# EAGLE design Isolator_14 (EAGLE 9.6.2)
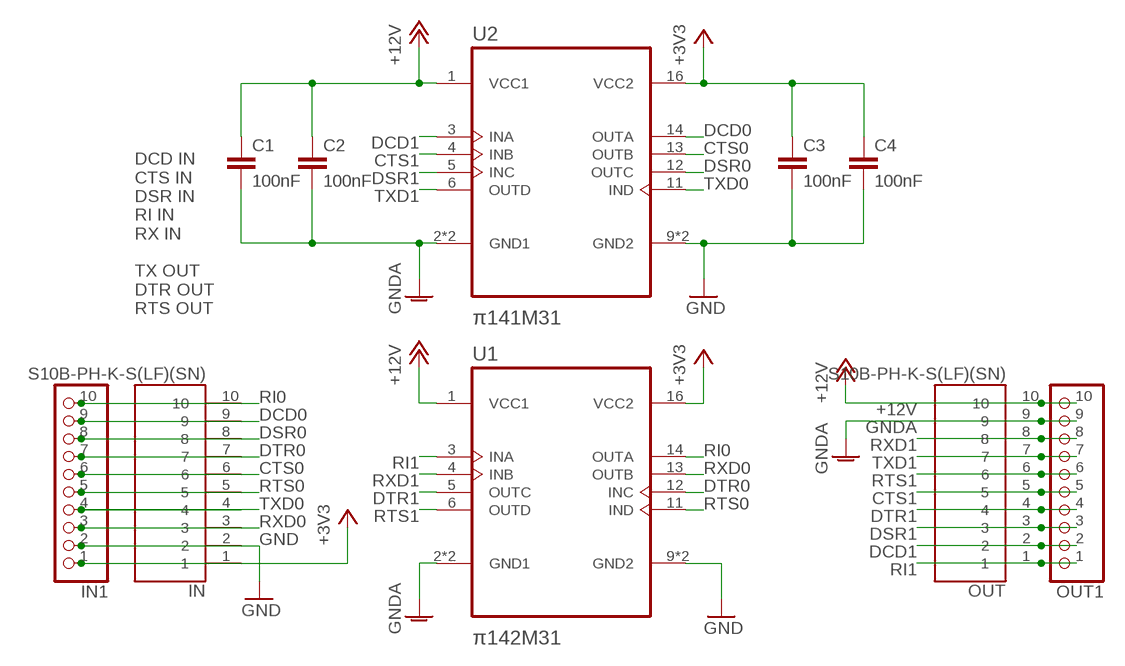
[diagram p0: schematic, sheet 1]

## Parts
C1  100nF  C-EUC0805  [C0805]
C2  100nF  C-EUC0805  [C0805]
C3  100nF  C-EUC0805  [C0805]
C4  100nF  C-EUC0805  [C0805]
IN  S10B-PH-K-S(LF)(SN)  [JST_S10B-PH-K-S(LF)(SN)]
IN1  PINHD-1X10  [1X10]
OUT  S10B-PH-K-S(LF)(SN)  [JST_S10B-PH-K-S(LF)(SN)]
OUT1  PINHD-1X10  [1X10]
U1  π142M31  π142X3X  [SOIC-16]
U2  π141M31  π141X3X  [SOIC-16]

## Nets
+3V3: C3.1 C4.1 IN1.1 IN.1 U1.16(VCC2) U2.16(VCC2)
+12V: C1.1 C2.1 OUT1.10 OUT.10 U1.1(VCC1) U2.1(VCC1)
CTS0: IN1.6 IN.6 U2.13(OUTB)
CTS1: OUT1.5 OUT.5 U2.4(INB)
DCD0: IN1.9 IN.9 U2.14(OUTA)
DCD1: OUT1.2 OUT.2 U2.3(INA)
DSR0: IN1.8 IN.8 U2.12(OUTC)
DSR1: OUT1.3 OUT.3 U2.5(INC)
DTR0: IN1.7 IN.7 U1.12(INC)
DTR1: OUT1.4 OUT.4 U1.5(OUTC)
GND: C3.2 C4.2 IN1.2 IN.2 U1.9(GND2) U1.15(GND2) U2.9(GND2) U2.15(GND2)
GNDA: C1.2 C2.2 OUT1.9 OUT.9 U1.2(GND1) U1.8(GND1) U2.2(GND1) U2.8(GND1)
RI0: IN1.10 IN.10 U1.14(OUTA)
RI1: OUT1.1 OUT.1 U1.3(INA)
RTS0: IN1.5 IN.5 U1.11(IND)
RTS1: OUT1.6 OUT.6 U1.6(OUTD)
RXD0: IN1.3 IN.3 U1.13(OUTB)
RXD1: OUT1.8 OUT.8 U1.4(INB)
TXD0: IN1.4 IN.4 U2.11(IND)
TXD1: OUT1.7 OUT.7 U2.6(OUTD)

## Notes on the sheet
- DCD IN
  CTS IN
  DSR IN
  RI IN
  RX IN
  
  TX OUT
  DTR OUT
  RTS OUT

## Library data of the parts
C1-C4 = rcl:C-EU: CAPACITOR, European symbol; SPICEPREFIX: C
IN OUT = S10B-PH-K-S_LF__SN_:S10B-PH-K-S(LF)(SN): PH Series 6 Position 2 mm Pitch Through Hole Side Entry Shrouded Header Check availability <https://pricing.snapeda.com/parts/S6B-PH-K-S%28LF%29%28SN%29/JST%20Sales/view-part?ref=eda>; AVAILABILITY: In Stock; DESCRIPTION: Connector Header Through Hole, Right Angle 6 position 0.079 (2.00mm); MF: JST Sales; MP: S6B-PH-K-S(LF)(SN); PACKAGE: None; PRICE: None; PURCHASE-URL: https://pricing.snapeda.com/search/part/S6B-PH-K-S(LF)(SN)/?ref=eda
IN1 OUT1 = pinhead:PINHD-1X10: PIN HEADER
U1 = π14XX3X:π142X3X: Check availability <https://pricing.snapeda.com/parts/ISO7240CDWR/Texas%20Instruments/view-part?ref=eda>; AVAILABILITY: In Stock; DESCRIPTION: Quad-channel, 4/0, 25-Mbps digital isolator; MF: Texas Instruments; MP: ISO7240CDWR; PACKAGE: SOIC-16 Texas Instruments; PRICE: None; PURCHASE-URL: https://pricing.snapeda.com/search/part/ISO7240CDWR/?ref=eda
U2 = π14XX3X:π141X3X: Check availability <https://pricing.snapeda.com/parts/ISO7240CDWR/Texas%20Instruments/view-part?ref=eda>; AVAILABILITY: In Stock; DESCRIPTION: Quad-channel, 4/0, 25-Mbps digital isolator; MF: Texas Instruments; MP: ISO7240CDWR; PACKAGE: SOIC-16 Texas Instruments; PRICE: None; PURCHASE-URL: https://pricing.snapeda.com/search/part/ISO7240CDWR/?ref=eda

## Board
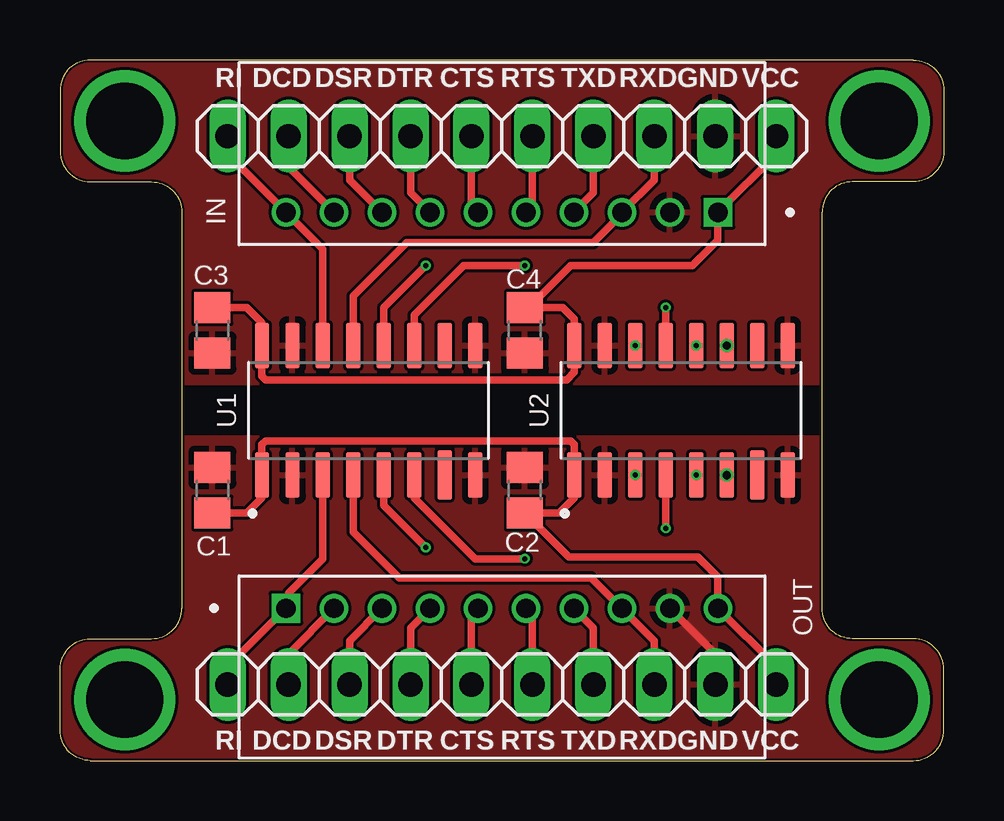
[diagram p1: board, top side]
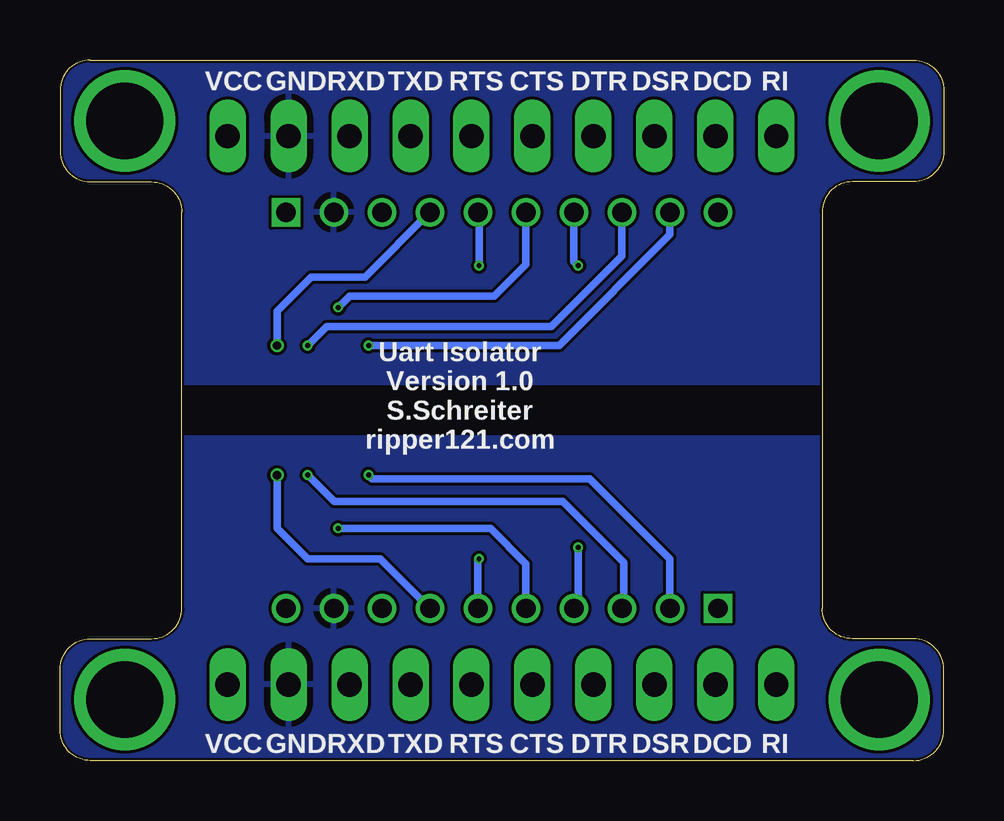
[diagram p2: board, bottom side, seen from below]

Size 36.83 x 29.21 mm. Coordinates in mm from the lower left corner, seen from the top.
Outline: 5.08,22.86 5.08,6.35 arc-90 3.81,5.08 1.27,5.08 arc90 0,3.81 0,1.27 arc90 1.27,0 35.56,0 arc90 36.83,1.27 36.83,3.81 arc90 35.56,5.08 33.02,5.08 arc-90 31.75,6.35 31.75,22.86 arc-90 33.02,24.13 35.56,24.13 arc90 36.83,25.4 36.83,27.94 arc90 35.56,29.21 1.27,29.21 arc90 0,27.94 0,25.4 arc90 1.27,24.13 3.81,24.13 arc-90 5.08,22.86
Copper layers (1*16): Top 0.035mm / dielectric 1.6mm / Bottom 0.035mm
Design rules "jlcpcb-2-layer *": minimum track width 12mil, minimum drill 0.2mm, track to track 5mil, track to pad 5mil, pad to pad 5mil, via to via 5mil, smd to smd 0mil, copper to edge 0.1mm, drill to drill 5mil, minimum pad ring 4mil, minimum via ring 4mil, stop-mask expansion 3mil, vias tented up to drill 100mil, thermal gap 10mil

### Footprints (pad centres in the part's own frame; a part is rotated, then mirrored left to right if it is on the bottom)
C0805 = smd 1.3 x 1.5: 1 -0.95,0; 2 0.95,0
JST_S10B-PH-K-S(LF)(SN) = drill 0.8 pad 1.2 square: 1 -9,0 | drill 0.8 pad 1.2: 2 -7,0; 3 -5,0; 4 -3,0; 5 -1,0; 6 1,0; 7 3,0; 8 5,0; 9 7,0; 10 9,0
1X10 = drill 1.016 long: 1 -11.43,0; 2 -8.89,0; 3 -6.35,0; 4 -3.81,0; 5 -1.27,0; 6 1.27,0; 7 3.81,0; 8 6.35,0; 9 8.89,0; 10 11.43,0
SOIC-16 = smd 1.9 x 0.6: 1 -2.7,4.445; 2 -2.7,3.175; 3 -2.7,1.905; 4 -2.7,0.635; 5 -2.7,-0.635; 6 -2.7,-1.905; 8 -2.7,-4.445; 9 2.7,-4.445; 10 2.7,-3.175; 11 2.7,-1.905; 12 2.7,-0.635; 13 2.7,0.635; 14 2.7,1.905; 15 2.7,3.175; 16 2.7,4.445 | smd 2.06 x 0.6: 7 -2.7,-3.175

### Placement (x,y rotation side)
C1  6.35,11.27 90 top
C2  19.37,11.27 90 top
C3  6.35,17.94 270 top
C4  19.37,17.94 270 top
IN  18.41,22.86 180 top
IN1  18.41,26.04 180 top
OUT  18.41,6.35 0 top
OUT1  18.41,3.17 0 top
U1  12.86,14.61 90 top
U2  25.88,14.61 90 top

### Tracks (layer width: path | path; a pad name or v marks a point on that pad's centre or on a via)
+3V3
  Top 0.305: C3.1 7.78,18.89 8.41,18.26 U1.16 8.41,16.03 8.57,15.88 21.11,15.88 21.43,16.19 U2.16 21.43,18.41 20.96,18.89 C4.1 19.53,18.89 21.27,20.64 26.35,20.64 27.41,21.7 IN.1 29.84,25.29 IN1.1
+12V
  Top 0.305: OUT1.10 29.84,3.92 OUT.10 27.41,7.66 26.57,8.5 21.19,8.5 C2.1 20.8,10.32 21.43,10.95 U2.1 21.43,13.18 21.27,13.34 8.57,13.34 8.41,13.18 U1.1 8.41,10.95 7.78,10.32 C1.1
CTS0  (via drill 0.2)
  Top 0.305: IN1.6 17.14,23.13 IN.6 | U2.13 v25.24,18.89
  Bottom 0.305: v25.24,18.89 24.77,19.37 18.73,19.37 17.41,20.68 IN.6
CTS1  (via drill 0.2)
  Top 0.305: OUT1.5 17.14,6.08 OUT.5 | v25.24,9.68 U2.4
  Bottom 0.305: OUT.5 17.41,8.21 18.89,9.68 v25.24,9.68
DCD0  (via drill 0.2)
  Top 0.305: IN1.9 9.53,24.75 IN.9 | U2.14
  Bottom 0.305: U2.14 16.03,17.3 11.41,21.92 IN.9
  other vias: 23.97,17.3
DCD1  (via drill 0.2)
  Top 0.305: OUT1.2 9.53,4.46 OUT.2 | U2.3
  Bottom 0.305: OUT.2 11.41,8.4 14.76,11.75 23.81,11.75 U2.3
  other vias: 23.97,11.91
DSR0  (via drill 0.2)
  Top 0.305: IN1.8 12.06,24.21 IN.8 | U2.12
  Bottom 0.305: IN.8 13.41,21.03 16.35,18.1 25.72,18.1 U2.12
  other vias: 26.51,17.3
DSR1  (via drill 0.2)
  Top 0.305: OUT1.3 12.06,5 OUT.3 | U2.5
  Bottom 0.305: U2.5 25.4,10.79 15.88,10.79 13.34,8.26 13.34,6.35 OUT.3
  other vias: 26.51,11.91
DTR0  (via drill 0.2)
  Top 0.305: IN1.7 14.61,23.67 IN.7 | U1.12 13.49,18.89 v15.24,20.64
  Bottom 0.305: v15.24,20.64 15.41,20.81 IN.7
DTR1  (via drill 0.2)
  Top 0.305: OUT1.4 14.61,5.54 OUT.4 | U1.5 13.49,10.64 v15.24,8.89
  Bottom 0.305: v15.24,8.89 15.24,6.35 OUT.4
GND
  pour Bottom: 0,29.21 36.83,29.21 36.83,15.72 0,15.72
  pour Top: 0,15.72 0,29.21 36.83,29.21 36.83,15.72
GNDA
  Top 0.305: OUT1.9 27.3,4.46 OUT.9
  pour Top: 0,13.49 36.83,13.49 36.83,0 0,0
  pour Bottom: 0,0 36.83,0 36.83,13.49 0,13.49
N$1  (via drill 3.2)
  other vias: 2.7,26.67
N$2  (via drill 3.2)
  other vias: 2.7,2.54
N$3  (via drill 3.2)
  other vias: 34.13,2.54
N$4  (via drill 3.2)
  other vias: 34.13,26.67
RI0
  Top 0.305: IN1.10 6.99,25.29 IN.10 10.95,21.32 U1.14
RI1
  Top 0.305: OUT1.1 6.99,3.92 OUT.1 9.53,6.35 9.53,6.99 10.95,8.41 U1.3
RTS0  (via drill 0.2)
  Top 0.305: IN1.5 19.68,23.13 IN.5 | v19.37,20.64 16.83,20.64 14.76,18.57 U1.11
  Bottom 0.305: v19.37,20.64 19.37,22.81 IN.5
RTS1  (via drill 0.2)
  Top 0.305: OUT1.6 19.68,6.08 OUT.6 | v19.37,8.41 17.3,8.41 14.76,10.95 U1.6
  Bottom 0.305: OUT.6 19.41,8.37 v19.37,8.41
RXD0
  Top 0.305: IN1.3 24.77,24.21 IN.3 23.41,22.78 22.23,21.59 14.45,21.59 12.22,19.37 U1.13
RXD1
  Top 0.305: OUT1.8 24.77,5 OUT.8 22.14,7.62 14.13,7.62 12.22,9.53 U1.4
TXD0  (via drill 0.35)
  Top 0.305: IN1.4 22.23,23.67 IN.4
  Bottom 0.305: IN.4 24.11,20.16 26.35,20.16 27.78,18.73 U2.11
  other vias: 27.78,17.3
TXD1  (via drill 0.35)
  Top 0.305: OUT1.7 22.23,5.54 OUT.7
  Bottom 0.305: OUT.7 23.48,8.41 26.51,8.41 27.78,9.68 v27.78,11.9

### Text on the board
tNames: RI | DCD | DSR | DTR | CTS | RTS | TXD | RXD | GND | VCC | RI | DCD | DSR | DTR | CTS | RTS | TXD | RXD | GND | VCC
bNames: RI | DCD | DSR | DTR | CTS | RTS | TXD | RXD | GND | VCC | Uart Isolator / Version 1.0 / S.Schreiter / ripper121.com | RI | DCD | DSR | DTR | CTS | RTS | TXD | RXD | GND | VCC